# Altium schematic sheet smart  controller.SchDoc
size A
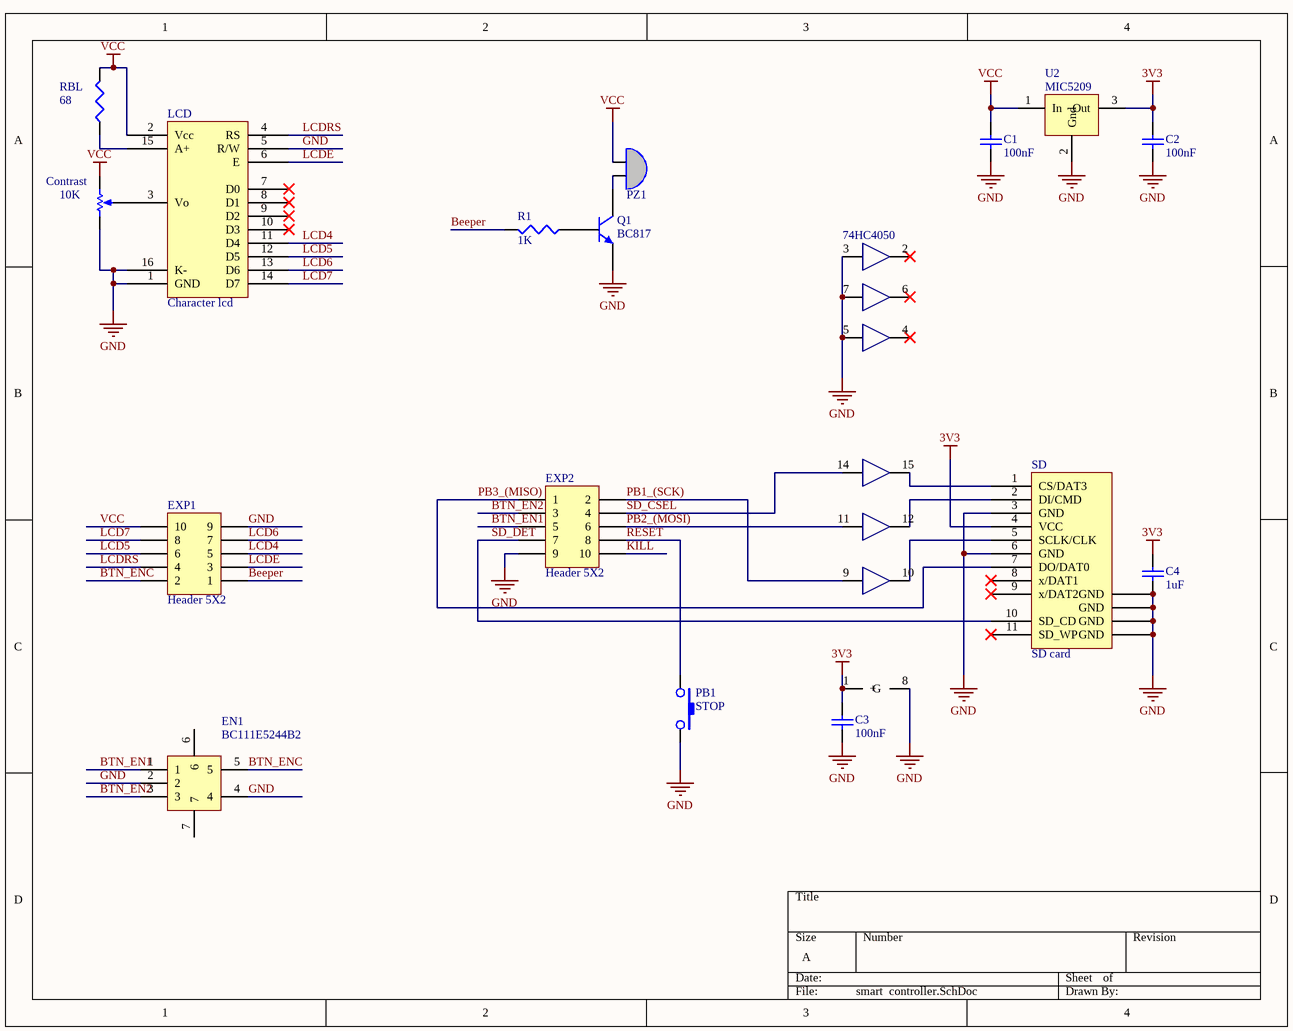
[diagram p0: smart  controller.SchDoc]

## Parts
C1  100nF  [Cap2012-0805]
C2  100nF  [Cap2012-0805]
C3  100nF  [Cap2012-0805]
C4  1uF  [Cap3216-1206]
Contrast  10K  [RES trimpot]
EN1  BC111E5244B2  [Rotary encoder]
EXP1  Header 5X2  [HDR2X5_exp]
EXP2  Header 5X2  [HDR2X5_exp]
LCD  Character lcd  [HDR1X16]
PB1  STOP  [SW 6x6mm]
PZ1  PIEZO  [PIEZO 11mm]  (value not drawn)
Q1  BC817  [SOT23_L]
R1  1K  [Res 2012-0805]
RBL  68  [Res 3216-1206]
SD  SD card  [SD_card socket]
U1  74HC4050  [SO16N]  (parts A,B,C,D,E,F,G of 7)
U2  MIC5209  [SOT-223]

## Nets
3V3: C2.2 C3.2 C4.2 SD.4(VCC) U1.1(+) U2.3(Out)
GND: C1.1 C2.1 C3.1 C4.1 Contrast.1(TOP) EN1.2 EN1.4 EXP1.9 EXP2.9 LCD.1(GND) LCD.5(R/W) LCD.16(K-) PB1.2 Q1.2(E) SD.3(GND) SD.6(GND) SD.12(GND) U1.3 U1.5 U1.7 U1.8(G) U2.2(Gnd) U2.4(Gnd)
VCC: C1.2 Contrast.3(BOT) EXP1.10 LCD.2(Vcc) PZ1.2 RBL.2 U2.1(In)
Beeper: EXP1.1 R1.2
BTN_EN1: EN1.1 EXP2.5
BTN_EN2: EN1.3 EXP2.3
BTN_ENC: EN1.5 EXP1.2
KILL: EXP2.10
LCD4: EXP1.5 LCD.11(D4)
LCD5: EXP1.6 LCD.12(D5)
LCD6: EXP1.7 LCD.13(D6)
LCD7: EXP1.8 LCD.14(D7)
LCDE: EXP1.3 LCD.6(E)
LCDRS: EXP1.4 LCD.4(RS)
PB1_(SCK): EXP2.2 U1.9
PB2_(MOSI): EXP2.6 U1.11
PB3_(MISO): EXP2.1 SD.7(DO/DAT0)
RESET: EXP2.8 PB1.1
SD_CSEL: EXP2.4 U1.14
SD_DET: EXP2.7 SD.10(SD_CD)
NetContrast_2: Contrast.2(TAP) LCD.3(Vo)
NetLCD_15: LCD.15(A+) RBL.1
NetPZ1_1: PZ1.1 Q1.3(C)
NetQ1_1: Q1.1(B) R1.1
NetSD_1: SD.1(CS/DAT3) U1.15
NetSD_2: SD.2(DI/CMD) U1.12
NetSD_5: SD.5(SCLK/CLK) U1.10

Not connected (* = marked no-connect by the designer): EN1 6 7; LCD 7(D0)* 8(D1)* 9(D2)* 10(D3)*; SD 8(x/DAT1)* 9(x/DAT2)* 11(SD_WP)*; U1 2* 4* 6*

## Library data of the parts
C1-C4 = Cap Semi: Capacitor (Semiconductor SIM Model); Published: 8-Jun-2000; Revision: July-2002: Re-released for DXP Platform.; Publisher: Altium Limited
  C1-C3: Value: 100nF
  C4: Value: 1uF
Contrast = POT
EN1 = Encoder: Rotary encoder mechanical
EXP1 EXP2 = Header 5X2: Header, 5-Pin, Dual row; LatestRevisionDate: 17-Jul-2002; LatestRevisionNote: Re-released for DXP Platform.; Publisher: Altium Limited
LCD = LCD characther
PB1 = SW-PB
Q1 = BC847C: NPN General-purpose Transistor; Published: 17-Sep-2003; LatestRevisionDate: 12-Dec-2006; LatestRevisionNote: IPC-7351 Footprint Added.; DatasheetVersion: 4-Feb-2002; PackageVersion: May-1999; PackageReference: SOT23; Publisher: Altium Limited; PackageDescription: 3-Pin SOT-23 Package 0.95 mm Pitch, 2.3 mm Lead Span; ComponentLink1Description: Manufacturer Link; ComponentLink1URL: http://www.semiconductors.philips.com/; ComponentLink2Description: Datasheet; ComponentLink2URL: http://www.semiconductors.philips.com/acrobat/datasheets/BC846_BC847_BC848_5.pdf
R1 RBL = Res3: Resistor; Published: 8-Jun-2000; Revision: July-2002: Re-released for DXP Platform.; Publisher: Altium Limited
  R1: Value: 1K
  RBL: Value: 68
U1 = 74HC4050: Hex high-to-low level shifter
U2 = MIC5209: 500mA Low-Noise LDO Regulator